# Altium schematic sheet 02 power input.SchDoc
size A3; SheetNumber: 3; SheetTotal: 16
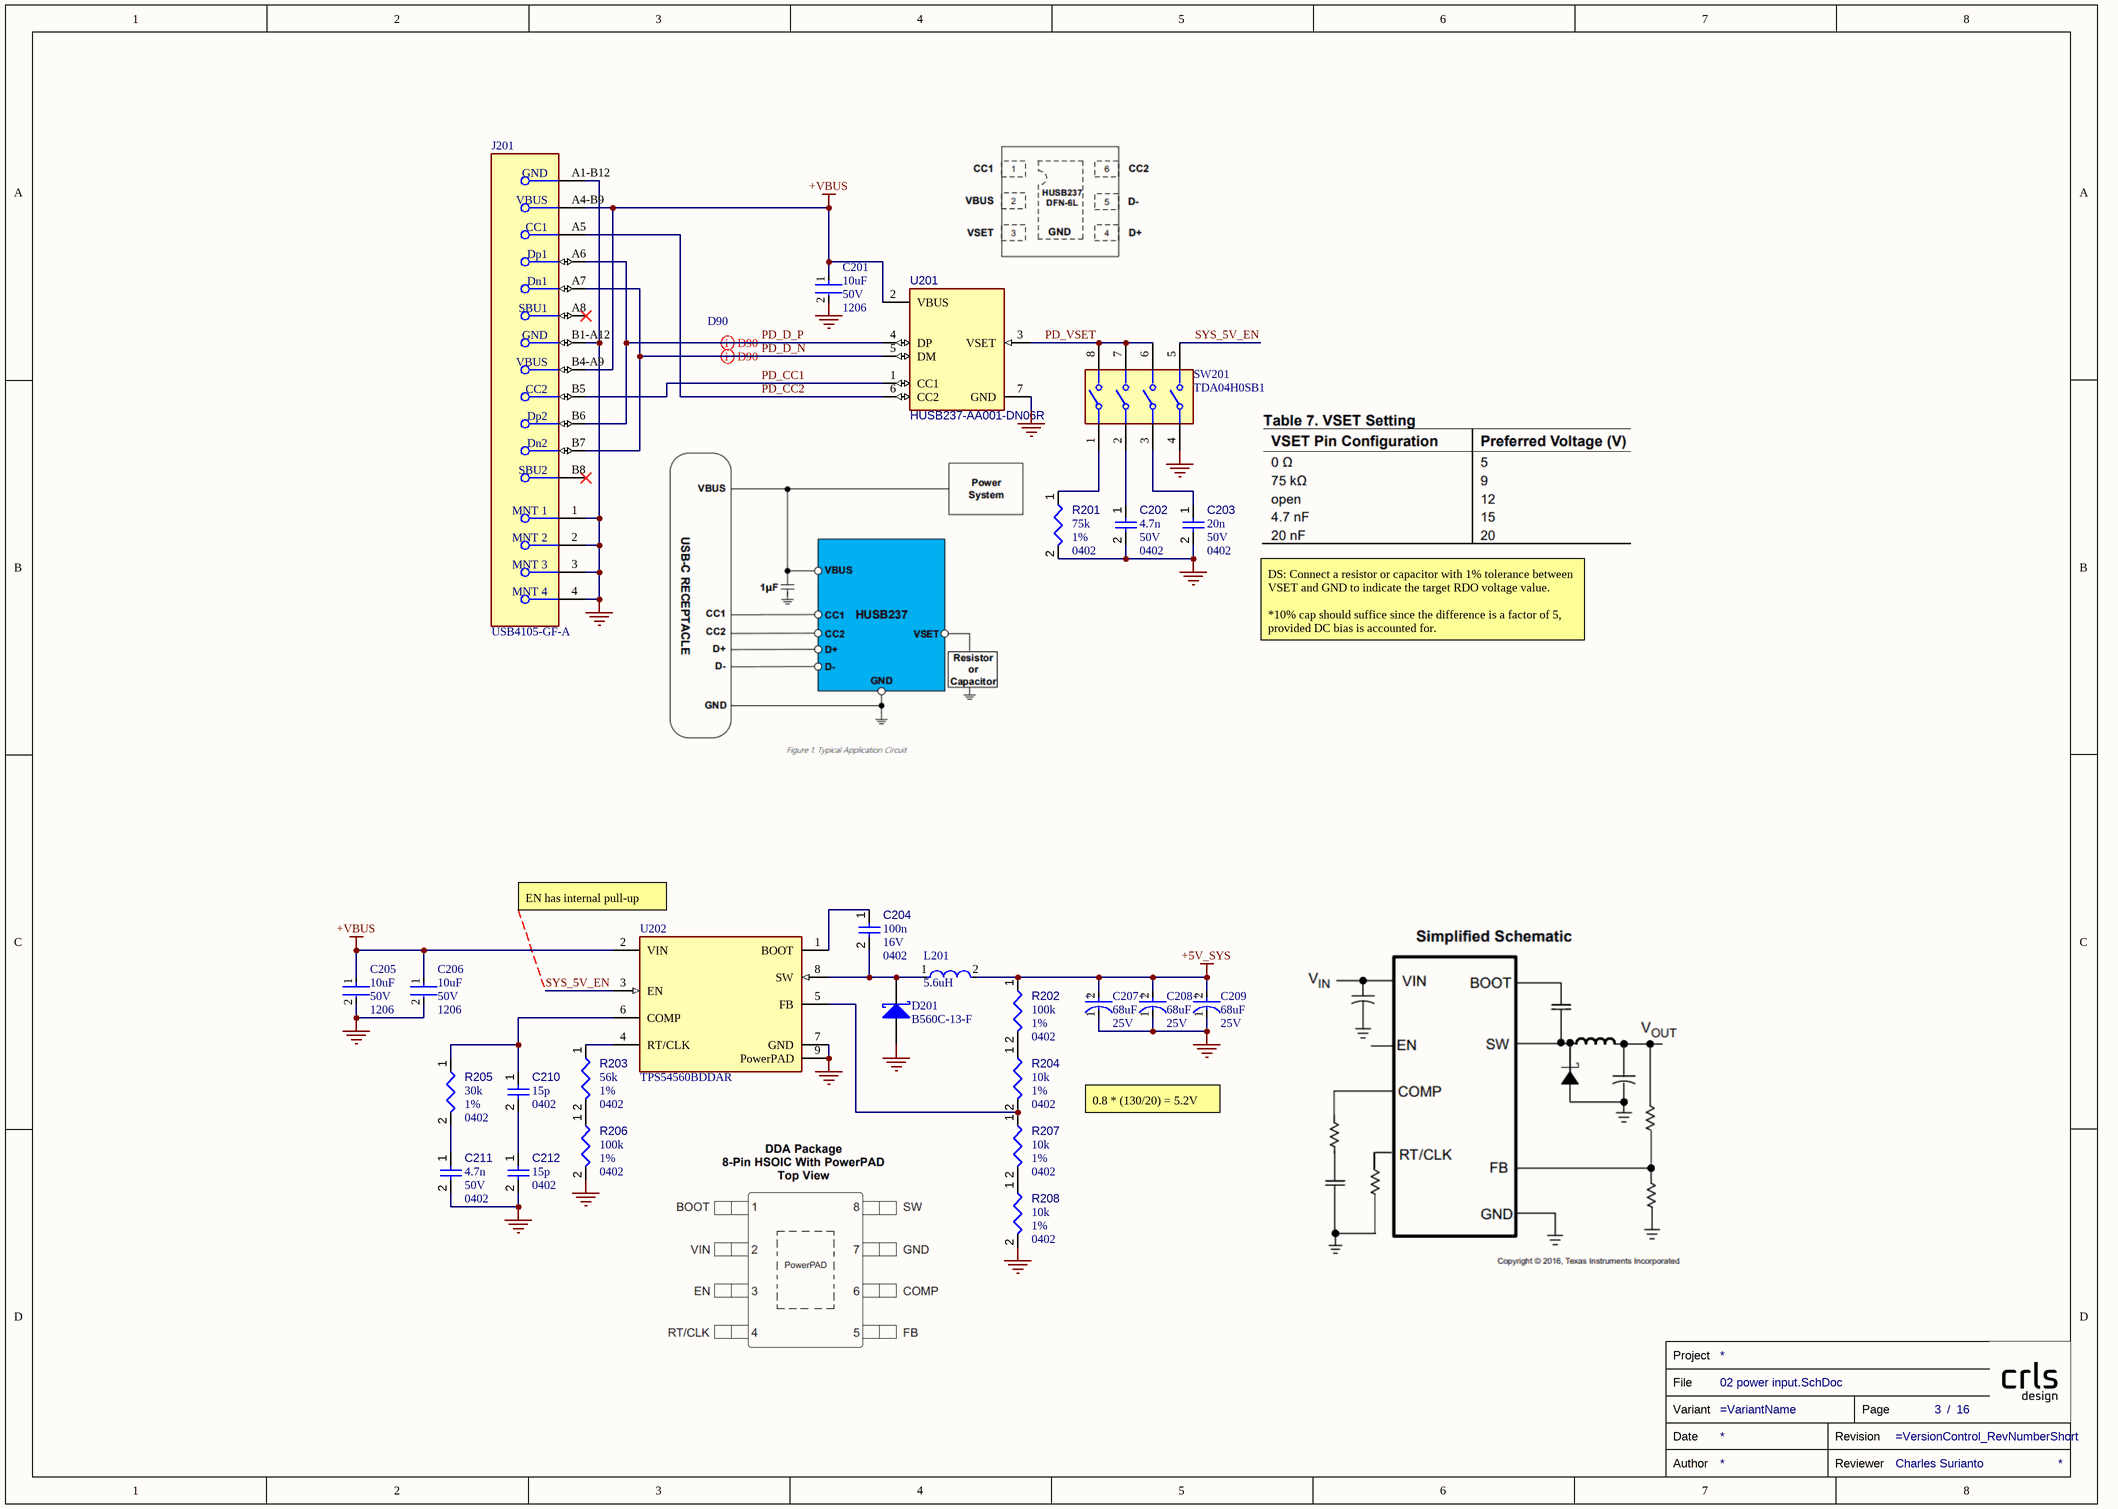
[diagram p0: 02 power input.SchDoc]

## Parts
C201  Capacitance: 10uF  Case/Package: 1206  Voltage Rating: 50V  [FP-CC1206-FD-MFG]  (hidden comment: CC1206KKX5R9BB106)
C202  value 4.7n  Case/Package: 0402  Voltage Rating: 50V  [CAPC0402(1005)60_L]  (hidden comment: Capacitors,0402,10%,4.7n,50V)
C203  value 20n  Case/Package: 0402  Voltage Rating: 50V  [CAPC0402(1005)60_L]  (hidden comment: Capacitors,0402,10%,20n,50V)
C204  value 100n  Case/Package: 0402  Voltage Rating: 16V  [CAPC0402(1005)60_L]  (hidden comment: Capacitors,0402,100n,16V)
C205  Capacitance: 10uF  Case/Package: 1206  Voltage Rating: 50V  [FP-CC1206-FD-MFG]  (hidden comment: CC1206KKX5R9BB106)
C206  Capacitance: 10uF  Case/Package: 1206  Voltage Rating: 50V  [FP-CC1206-FD-MFG]  (hidden comment: CC1206KKX5R9BB106)
C207  Voltage Rating: 25V  Capacitance: 68uF  [FP-POSCAP-D3L-MFG]  (hidden comment: 25TQC68MYF)
C208  Voltage Rating: 25V  Capacitance: 68uF  [FP-POSCAP-D3L-MFG]  (hidden comment: 25TQC68MYF)
C209  Voltage Rating: 25V  Capacitance: 68uF  [FP-POSCAP-D3L-MFG]  (hidden comment: 25TQC68MYF)
C210  value 15p  Case/Package: 0402  [CAPC0402(1005)60_L]  (hidden comment: Capacitors,0402,15p)
C211  value 4.7n  Case/Package: 0402  Voltage Rating: 50V  [CAPC0402(1005)60_L]  (hidden comment: Capacitors,0402,10%,4.7n,50V)
C212  value 15p  Case/Package: 0402  [CAPC0402(1005)60_L]  (hidden comment: Capacitors,0402,15p)
D201  B560C-13-F  [DIOD-B5X0C-2_M]
J201  USB4105-GF-A  [FP-USB4105-GF-A-MFG]
L201  Inductance: 5.6uH  [FP-IHLP-2525EZ-FP_2_413x3-MFG]  (hidden comment: IHLP2525EZER5R6M01)
R201  value 75k  Case/Package: 0402  Tolerance: 1%  [RESC0402(1005)_L]  (hidden comment: Resistors,0402,1%,75k)
R202  value 100k  Case/Package: 0402  Tolerance: 1%  [RESC0402(1005)_L]  (hidden comment: Resistors,0402,1%,100k)
R203  value 56k  Case/Package: 0402  Tolerance: 1%  [RESC0402(1005)_L]  (hidden comment: Resistors,0402,1%,56k)
R204  value 10k  Case/Package: 0402  Tolerance: 1%  [RESC0402(1005)_L]  (hidden comment: Resistors,0402,1%,10k)
R205  value 30k  Case/Package: 0402  Tolerance: 1%  [RESC0402(1005)_L]  (hidden comment: Resistors,0402,1%,30k)
R206  value 100k  Case/Package: 0402  Tolerance: 1%  [RESC0402(1005)_L]  (hidden comment: Resistors,0402,1%,100k)
R207  value 10k  Case/Package: 0402  Tolerance: 1%  [RESC0402(1005)_L]  (hidden comment: Resistors,0402,1%,10k)
R208  value 10k  Case/Package: 0402  Tolerance: 1%  [RESC0402(1005)_L]  (hidden comment: Resistors,0402,1%,10k)
SW201  TDA04H0SB1  [FP-TDA04H0SB1-MFG]
TB?  Reviewer: Charles Surianto  (hidden comment: TITLE_BLOCK)  (graphical)
U201  HUSB237-AA001-DN06R  [TDFN-6_L2.0-W2.0-P0.65-TL-EP]
U202  TPS54560BDDAR  [FP-DDA0008E-MFG]

## Nets
+5V_SYS: C207.2(A) C208.2(A) C209.2(A) L201.2 R202.1
+VBUS: C201.1 C205.1 C206.1 J201.A4-B9(VBUS) J201.B4-A9(VBUS) U201.2(VBUS) U202.2(VIN)
GND: C201.2 C202.2 C203.2 C205.2 C206.2 C207.1(C) C208.1(C) C209.1(C) C211.2 C212.2 D201.2(A) J201.1(MNT_1) J201.2(MNT_2) J201.3(MNT_3) J201.4(MNT_4) J201.A1-B12(GND) J201.B1-A12(GND) R201.2 R206.2 R208.2 SW201.4 U201.7(GND) U202.7(GND) U202.9(PowerPAD)
PD_CC1: J201.B5(CC2) U201.1(CC1)
PD_CC2: J201.A5(CC1) U201.6(CC2)
PD_D_N: J201.A7(Dn1) J201.B7(Dn2) U201.5(DM)
PD_D_P: J201.A6(Dp1) J201.B6(Dp2) U201.4(DP)
PD_VSET: SW201.6 SW201.7 SW201.8 U201.3(VSET)
SYS_5V_EN: SW201.5 U202.3(EN)
NetC202_1: C202.1 SW201.2
NetC203_1: C203.1 SW201.3
NetC204_1: C204.1 U202.1(BOOT)
NetC204_2: C204.2 D201.1(K) L201.1 U202.8(SW)
NetC210_1: C210.1 R205.1 U202.6(COMP)
NetC210_2: C210.2 C212.1
NetC211_1: C211.1 R205.2
NetR201_1: R201.1 SW201.1
NetR202_2: R202.2 R204.1
NetR203_1: R203.1 U202.4(RT/CLK)
NetR203_2: R203.2 R206.1
NetR204_2: R204.2 R207.1 U202.5(FB)
NetR207_2: R207.2 R208.1

Not connected (* = marked no-connect by the designer): J201 A8(SBU1)* B8(SBU2)*

## Layout directives
differential pair; differential pair class D90: PD_D_N, PD_D_P

## Notes on the sheet
- DS: Connect a resistor or capacitor with 1% tolerance between VSET and GND to indicate the target RDO voltage value.
  *10% cap should suffice since the difference is a factor of 5, provided DC bias is accounted for.
- (near U202) EN has internal pull-up
- 0.8 * (130/20) = 5.2V
- (in symbol CMP-05428-000983-1) +
- (in symbol TITLE_BLOCK) Project; File; Variant; Page; /; Date; Revision; Author; Reviewer

## Library data of the parts
C201 C205 C206 = CMP-03422-001420-1: CAP CER 10UF 50V X5R 1206; Tolerance: 10%; Voltage Rating (DC): 50V; Width: 0.063inch; Halogen Free: Halogen Free; Mount: Surface Mount; Dielectric: X5R; Max Operating Temperature: 85°C; Lead Free: Lead Free; Thickness: 0.075inch; Min Operating Temperature: -55°C; Length: 0.126inch; Packaging: Tape and Reel; RoHS Compliant: Yes
C202-C204 C210-C212 = Capacitors: Capacitor; Component Type: Capacitors
  C202 C203 C211: Tolerance: 10%
C207-C209 = CMP-05428-000983-1: Molded Tantalum Polymer Capacitor 68uF 20% 25V life 2000Hours SMD 2917; ESR (Equivalent Series Resistance): 70mR; Lead Free: Lead Free; Packaging: Tape and Reel; Max Operating Temperature: 105°C; Features: General Purpose; REACH SVHC: No SVHC; RoHS Compliant: Yes; Voltage Rating (DC): 25V; Mount: Surface Mount; Min Operating Temperature: -55°C; Case Code (Imperial): 2917; Case Code (Metric): 7343; Tolerance: 20%; Series: POSCAP™ TQC; Case/Package: 2917; Package Quantity: 2500
D201 = CMP-2000-05098-2: Schottky Barrier Rectifier, 5 A, 60 V, -55 to 125 degC, 2-Pin SMD, RoHS, Tape and Reel; Ir - Reverse Current: 500uA; Configuration: Single; Ifsm - Forward Surge Current: 100A; Vrrm - Repetitive Reverse Voltage: 60V; Brand: DiodesIncorporated; Vf - Forward Voltage: 0.7V; If - Forward Current: 5A; Unit Weight: 0.007408oz; Type: SchottkyBarrierRectifier; Package / Case: SMC; Manufacturer URL: http://www.diodes.com/; Datasheet URL: https://datasheet.ciiva.com/27052/1538961-27052355.pdf; Factory Pack Quantity: 3000; Height: 2.5mm; Width: 6.22mm; Product Category: SchottkyDiodes&Rectifiers; Minimum Operating Temperature: -55C; Manufacturer: DiodesIncorporated; Datasheet Version: Rev. 7-2, 06/2007; Product: SchottkyDiodes; Maximum Operating Temperature: +125C; Operating Temperature Range: -55Cto+125C; Technology: Si; Length: 7.11mm; RoHS: True; Packaging: Reel; Termination Style: SMD/SMT; Series: B560; Mounting Style: SMD/SMT
J201 = CMP-245163-000001-1: CONN RCPT USB2.0 TYPEC 5A; Manufacturer: GCT; Voltage Rating: 20V; Is Female: yes; Current Rating: 5/6.25/1.25/0.25A; Number Of Contacts: 16; Conn Orientation: Right Angle; Device Class L1: Connectors; Category: Conn; Lead Free: Yes; RoHS: TRUE; Temperature Range High: +85°C; Digikey Description: CONN RCPT USB2.0 TYPEC 5A; Device Class L3: unset; ComponentLink2Description: Datasheet; Manufacturer Part Number: USB4105-GF-A; Package: 0; Usb Standard: USB 2.0; Device Class L2: USB Connectors; Automotive: No; Temperature Range Low: -40°C; Height: 3.46mm; Temperature: -40°C to +85°C; Contact Material: Gold,Nickel; ComponentLink2URL: https://gct.co/files/drawings/usb4105.pdf; Octopart: https://octopart.com/usb4105-gf-a-gct-106627878
L201 = CMP-02424-000708-1: Commercial Inductors, High Saturation Series 5.6uH 6A 34.4mΩ 20%; Self Resonant Frequency: 1MHz; Test Frequency: 100kHz; Saturation Current: 7A; Core Material: Metal; Shielding: Shielded; DC Resistance (DCR): 34.4mR; Depth: 6.72mm; Height - Seated (Max): 0.197inch; Min Operating Temperature: -55°C; Mount: Surface Mount; Max DC Current: 6A; Case Code (Metric): 6363; RoHS Compliant: Yes; Max Operating Temperature: 125°C; Termination: SMD/SMT; Series: IHLP-2525EZ-01; Length: 6.86mm; Packaging: Tape and Reel; Lead Free: Lead Free; Rated Current-Max: 7A; Case Code (Imperial): 2525; Radiation Hardening: No; Current Rating: 6A; Package Quantity: 500; Height: 5mm; Inductance Tolerance: 20%; Military Standard: Not; Width: 0.255inch; Tolerance: 20%; Case/Package: 2525; Number of Pins: 2525
R201-R208 = Resistors: Resistor; Component Type: Resistors
SW201 = CMP-10033-000006-1: SWITCH SLIDE DIP SPST 25MA 24V; Number of Switches: 4; Body Material: Polyphenylene; Pitch: 0.05inch; Washable: Yes; Lead/Base Style: Gull Wing; Electrical Life: 1000Cycles; Actuator Material: Polymer; Actuator Type: Slide (Standard); Contact Resistance: 100mR; Actuator Length: 0mm; Current Rating: 100mA; Number of Positions: 4; Reach SVHC Compliant: Yes; Throw Configuration: SPST; Orientation: Straight; Lead Free: Lead Free; Max Current Rating: 25mA; Length: 6.21mm; Packaging: Rail/Tube; Terminal Pitch: 1.27mm; Max Voltage Rating (DC): 24V; Case/Package: DIP; Depth: 8.12mm; Termination: Gull Wing; Contact Plating: Gold; Contact Material: Copper Alloy; Contact Current Rating: 25mA; Voltage Rating (DC): 24V; Max Operating Temperature: 85°C; Package Quantity: 70; Mount: Surface Mount; RoHS Compliant: Yes; Mechanical Life: 1000Cycles; Radiation Hardening: No; Series: TDA; Min Operating Temperature: -40°C
U201 = HUSB237-AA001-DN06R: Type:Power Receiver Controller Protocol:- Number of Channels:- Output Power:100W Output Voltage:5V；20V；15V；12V；9V Voltage - Supply:3V~22V Voltage - Supply:3V~22V Operating Temperature:-40℃~+125℃ Operating Temperature:-40℃~+125℃; Manufacturer: Hynetek(慧能泰); AddInBom: yes; ModelId: 3cc178adeb024a6c8e3bb1bcf2ff5d46ÂŽ0819f05c4eef4c71ace90d822a990e87; ModelName: TDFN-6_L2.0-W2.0-H0.8-P0.65; ModelTransform: 79.527,78.74,0,0,0,0,0,0,0; Output Power: 100W; Voltage - Supply: 3V~22V; Symbol: HUSB237-AA001-DN06R; Device: HUSB237-AA001-DN06R; LCSC Part Name: USB Type-C Power Delivery Sink Controller; SupplierPart: C22373734; ManufacturerPart: HUSB237-AA001-DN06R; Supplier Footprint: DFN-6L-EP(2x2); JLCPCB Part Class: Extended Part; Datasheet: https://item.szlcsc.com/datasheet/HUSB237-AA001-DN06R/23868913.html; Supplier: LCSC; ConvertToPcb: yes; FootprintName: TDFN-6_L2.0-W2.0-P0.65-TL-EP; Type: Power Receiver Controller; Protocol: -; Number of Channels: -; Output Voltage: 5V；20V；15V；12V；9V; Operating Temperature: -40℃~+125℃
U202 = CMP-04918-000346-1: IC REG CTRLR
TB? = TITLE_BLOCK: Review Date: *